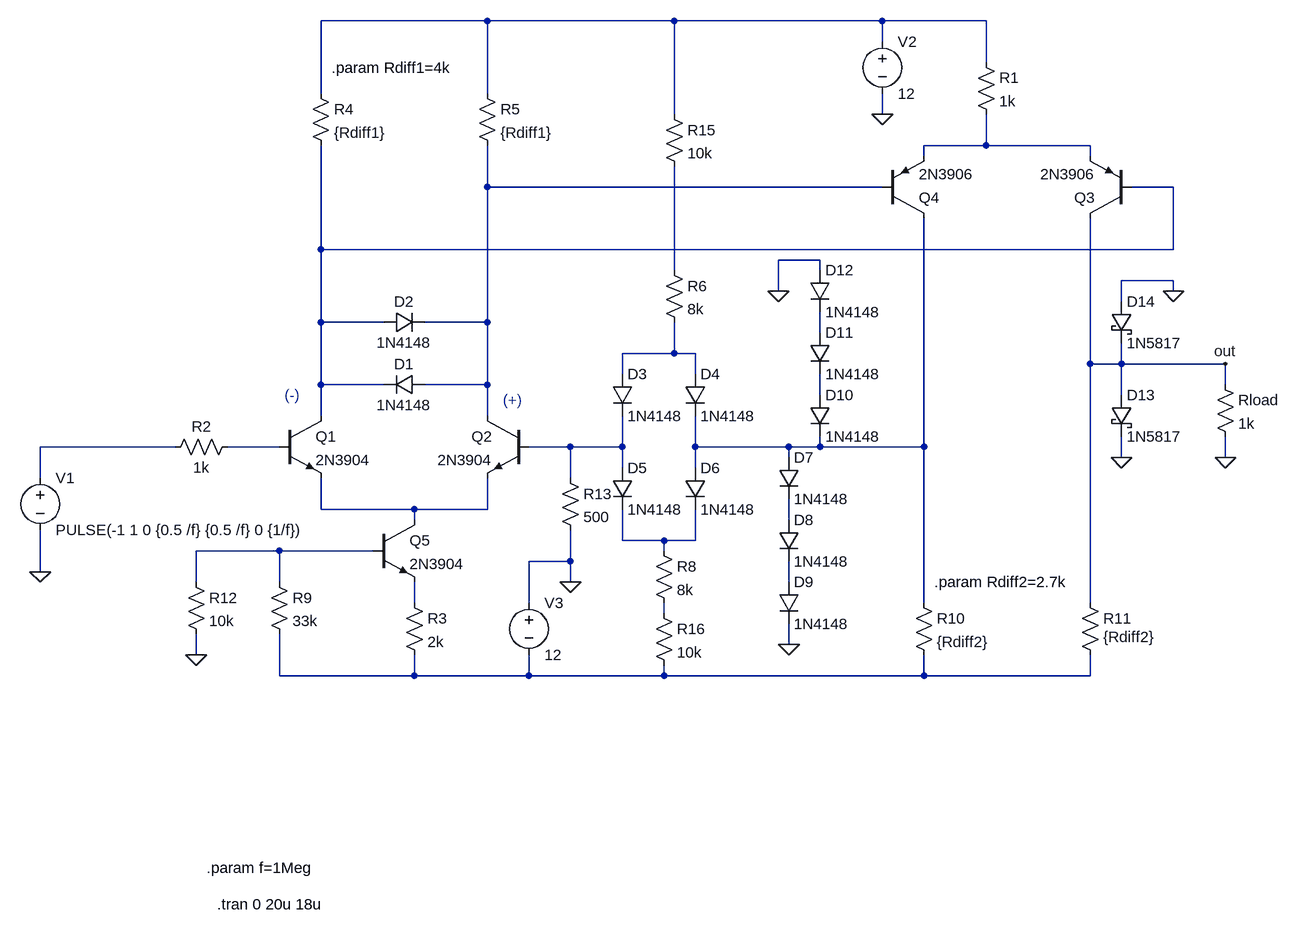
[diagram p0: schematic schmitt trigger.asc]
schmitt trigger.asc, the LTspice schematic file:
Version 4
SHEET 1 3000 1268
WIRE 672 -560 416 -560
WIRE 960 -560 672 -560
WIRE 1280 -560 960 -560
WIRE 1440 -560 1280 -560
WIRE 1280 -528 1280 -560
WIRE 1440 -496 1440 -560
WIRE 416 -448 416 -560
WIRE 672 -448 672 -560
WIRE 960 -416 960 -560
WIRE 1280 -416 1280 -448
WIRE 1440 -368 1440 -416
WIRE 1440 -368 1344 -368
WIRE 1600 -368 1440 -368
WIRE 1344 -352 1344 -368
WIRE 1600 -352 1600 -368
WIRE 672 -304 672 -368
WIRE 1280 -304 672 -304
WIRE 1728 -304 1664 -304
WIRE 416 -208 416 -368
WIRE 1728 -208 1728 -304
WIRE 1728 -208 416 -208
WIRE 1184 -192 1120 -192
WIRE 960 -176 960 -336
WIRE 1184 -176 1184 -192
WIRE 1728 -160 1648 -160
WIRE 1120 -144 1120 -192
WIRE 1728 -144 1728 -160
WIRE 1648 -128 1648 -160
WIRE 416 -96 416 -208
WIRE 512 -96 416 -96
WIRE 672 -96 672 -304
WIRE 672 -96 576 -96
WIRE 1184 -80 1184 -112
WIRE 960 -48 960 -96
WIRE 960 -48 880 -48
WIRE 992 -48 960 -48
WIRE 1600 -32 1600 -256
WIRE 1648 -32 1648 -64
WIRE 1648 -32 1600 -32
WIRE 1808 -32 1648 -32
WIRE 880 -16 880 -48
WIRE 992 -16 992 -48
WIRE 416 0 416 -96
WIRE 512 0 416 0
WIRE 672 0 672 -96
WIRE 672 0 576 0
WIRE 1808 0 1808 -32
WIRE 1184 16 1184 -16
WIRE 1648 16 1648 -32
WIRE 416 48 416 0
WIRE 672 48 672 0
WIRE 192 96 -16 96
WIRE 352 96 272 96
WIRE 800 96 736 96
WIRE 880 96 880 48
WIRE 880 96 800 96
WIRE 992 96 992 48
WIRE 1136 96 992 96
WIRE 1184 96 1184 80
WIRE 1184 96 1136 96
WIRE 1344 96 1344 -256
WIRE 1344 96 1184 96
WIRE 1136 112 1136 96
WIRE 1648 112 1648 80
WIRE 1808 112 1808 80
WIRE 880 128 880 96
WIRE 992 128 992 96
WIRE -16 144 -16 96
WIRE 800 144 800 96
WIRE 416 192 416 144
WIRE 560 192 416 192
WIRE 672 192 672 144
WIRE 672 192 560 192
WIRE 560 208 560 192
WIRE 1136 208 1136 176
WIRE 880 240 880 192
WIRE 944 240 880 240
WIRE 992 240 992 192
WIRE 992 240 944 240
WIRE 352 256 224 256
WIRE 496 256 352 256
WIRE 944 256 944 240
WIRE 800 272 800 224
WIRE 800 272 736 272
WIRE -16 288 -16 224
WIRE 224 304 224 256
WIRE 352 304 352 256
WIRE 800 304 800 272
WIRE 1136 304 1136 272
WIRE 560 336 560 304
WIRE 736 336 736 272
WIRE 1344 336 1344 96
WIRE 1600 336 1600 -32
WIRE 944 352 944 336
WIRE 1136 400 1136 368
WIRE 224 416 224 384
WIRE 352 448 352 384
WIRE 560 448 560 416
WIRE 560 448 352 448
WIRE 736 448 736 416
WIRE 736 448 560 448
WIRE 944 448 944 432
WIRE 944 448 736 448
WIRE 1344 448 1344 416
WIRE 1344 448 944 448
WIRE 1600 448 1600 416
WIRE 1600 448 1344 448
FLAG 1280 -416 0
FLAG 1136 400 0
FLAG -16 288 0
FLAG 800 304 0
FLAG 224 416 0
FLAG 1120 -144 0
FLAG 1728 -144 0
FLAG 1648 112 0
FLAG 1808 112 0
FLAG 1808 -32 out
SYMBOL voltage -16 128 R0
WINDOW 123 0 0 Left 0
WINDOW 39 0 0 Left 0
SYMATTR InstName V1
SYMATTR Value PULSE(-1 1 0 {0.5 /f} {0.5 /f} 0 {1/f})
SYMBOL npn 352 48 R0
SYMATTR InstName Q1
SYMATTR Value 2N3904
SYMBOL npn 736 48 M0
SYMATTR InstName Q2
SYMATTR Value 2N3904
SYMBOL res 400 -464 R0
SYMATTR InstName R4
SYMATTR Value {Rdiff1}
SYMBOL res 656 -464 R0
SYMATTR InstName R5
SYMATTR Value {Rdiff1}
SYMBOL pnp 1664 -256 R180
SYMATTR InstName Q3
SYMATTR Value 2N3906
SYMBOL pnp 1280 -256 M180
SYMATTR InstName Q4
SYMATTR Value 2N3906
SYMBOL diode 576 -16 R90
WINDOW 0 0 32 VBottom 2
WINDOW 3 32 32 VTop 2
SYMATTR InstName D1
SYMATTR Value 1N4148
SYMBOL diode 512 -80 R270
WINDOW 0 32 32 VTop 2
WINDOW 3 0 32 VBottom 2
SYMATTR InstName D2
SYMATTR Value 1N4148
SYMBOL diode 864 -16 R0
SYMATTR InstName D3
SYMATTR Value 1N4148
SYMBOL diode 976 -16 R0
SYMATTR InstName D4
SYMATTR Value 1N4148
SYMBOL diode 864 128 R0
SYMATTR InstName D5
SYMATTR Value 1N4148
SYMBOL diode 976 128 R0
SYMATTR InstName D6
SYMATTR Value 1N4148
SYMBOL res 944 -192 R0
SYMATTR InstName R6
SYMATTR Value 8k
SYMBOL res 928 240 R0
SYMATTR InstName R8
SYMATTR Value 8k
SYMBOL res 1328 320 R0
SYMATTR InstName R10
SYMATTR Value {Rdiff2}
SYMBOL res 1584 320 R0
WINDOW 3 36 68 Left 2
SYMATTR Value {Rdiff2}
SYMATTR InstName R11
SYMBOL voltage 1280 -544 R0
SYMATTR InstName V2
SYMATTR Value 12
SYMBOL res 784 128 R0
SYMATTR InstName R13
SYMATTR Value 500
SYMBOL diode 1120 304 R0
SYMATTR InstName D9
SYMATTR Value 1N4148
SYMBOL diode 1168 -176 R0
SYMATTR InstName D12
SYMATTR Value 1N4148
SYMBOL res 1424 -512 R0
SYMATTR InstName R1
SYMATTR Value 1k
SYMBOL diode 1120 208 R0
SYMATTR InstName D8
SYMATTR Value 1N4148
SYMBOL diode 1168 -80 R0
SYMATTR InstName D11
SYMATTR Value 1N4148
SYMBOL voltage 736 320 R0
WINDOW 123 0 0 Left 0
WINDOW 39 0 0 Left 0
SYMATTR InstName V3
SYMATTR Value 12
SYMBOL npn 496 208 R0
SYMATTR InstName Q5
SYMATTR Value 2N3904
SYMBOL res 544 320 R0
SYMATTR InstName R3
SYMATTR Value 2k
SYMBOL res 336 288 R0
SYMATTR InstName R9
SYMATTR Value 33k
SYMBOL res 208 288 R0
SYMATTR InstName R12
SYMATTR Value 10k
SYMBOL res 288 80 R90
WINDOW 0 0 56 VBottom 2
WINDOW 3 32 56 VTop 2
SYMATTR InstName R2
SYMATTR Value 1k
SYMBOL res 944 -432 R0
SYMATTR InstName R15
SYMATTR Value 10k
SYMBOL res 928 336 R0
SYMATTR InstName R16
SYMATTR Value 10k
SYMBOL diode 1120 112 R0
SYMATTR InstName D7
SYMATTR Value 1N4148
SYMBOL diode 1168 16 R0
SYMATTR InstName D10
SYMATTR Value 1N4148
SYMBOL schottky 1632 16 R0
SYMATTR InstName D13
SYMATTR Value 1N5817
SYMATTR Description Diode
SYMATTR Type diode
SYMBOL schottky 1632 -128 R0
SYMATTR InstName D14
SYMATTR Value 1N5817
SYMATTR Description Diode
SYMATTR Type diode
SYMBOL res 1792 -16 R0
SYMATTR InstName Rload
SYMATTR Value 1k
TEXT 256 800 Left 2 !.tran 0 20u 18u
TEXT 240 744 Left 2 !.param f=1Meg
TEXT 696 24 Left 2 ;(+)
TEXT 360 16 Left 2 ;(-)
TEXT 1360 304 Left 2 !.param Rdiff2=2.7k
TEXT 432 -488 Left 2 !.param Rdiff1=4k

The netlist it stands for:
* schmitt trigger.asc
V1 N009 0 PULSE(-1 1 0 {0.5 /f} {0.5 /f} 0 {1/f})
Q1 N004 N010 N013 0 2N3904
Q2 N003 N011 N013 0 2N3904
R4 N001 N004 {Rdiff1}
R5 N001 N003 {Rdiff1}
Q3 out N004 N002 0 2N3906
Q4 N012 N003 N002 0 2N3906
D1 N003 N004 1N4148
D2 N004 N003 1N4148
D3 N007 N011 1N4148
D4 N007 N012 1N4148
D5 N011 N015 1N4148
D6 N012 N015 1N4148
R6 N005 N007 8k
R8 N015 N019 8k
R10 N012 N020 {Rdiff2}
R11 out N020 {Rdiff2}
V2 N001 0 12
R13 N011 0 500
D9 N017 0 1N4148
D12 0 N006 1N4148
R1 N001 N002 1k
D8 N014 N017 1N4148
D11 N006 N008 1N4148
V3 0 N020 12
Q5 N013 N016 N018 0 2N3904
R3 N018 N020 2k
R9 N016 N020 33k
R12 N016 0 10k
R2 N010 N009 1k
R15 N001 N005 10k
R16 N019 N020 10k
D7 N012 N014 1N4148
D10 N008 N012 1N4148
D13 out 0 1N5817
D14 0 out 1N5817
Rload out 0 1k
.model D D
.lib standard.dio
.model NPN NPN
.model PNP PNP
.lib standard.bjt
.tran 0 20u 18u
.param f=1Meg
* (+)
* (-)
.param Rdiff2=2.7k
.param Rdiff1=4k
.backanno
.end